# EasyEDA schematic schematic-easyeda.json
TITLE: Badge Adapter; REV: 1.0; Date: 2020-01-03; Sheet: 1/1; Drawn By: uri_6323; Company: Uri Shaked
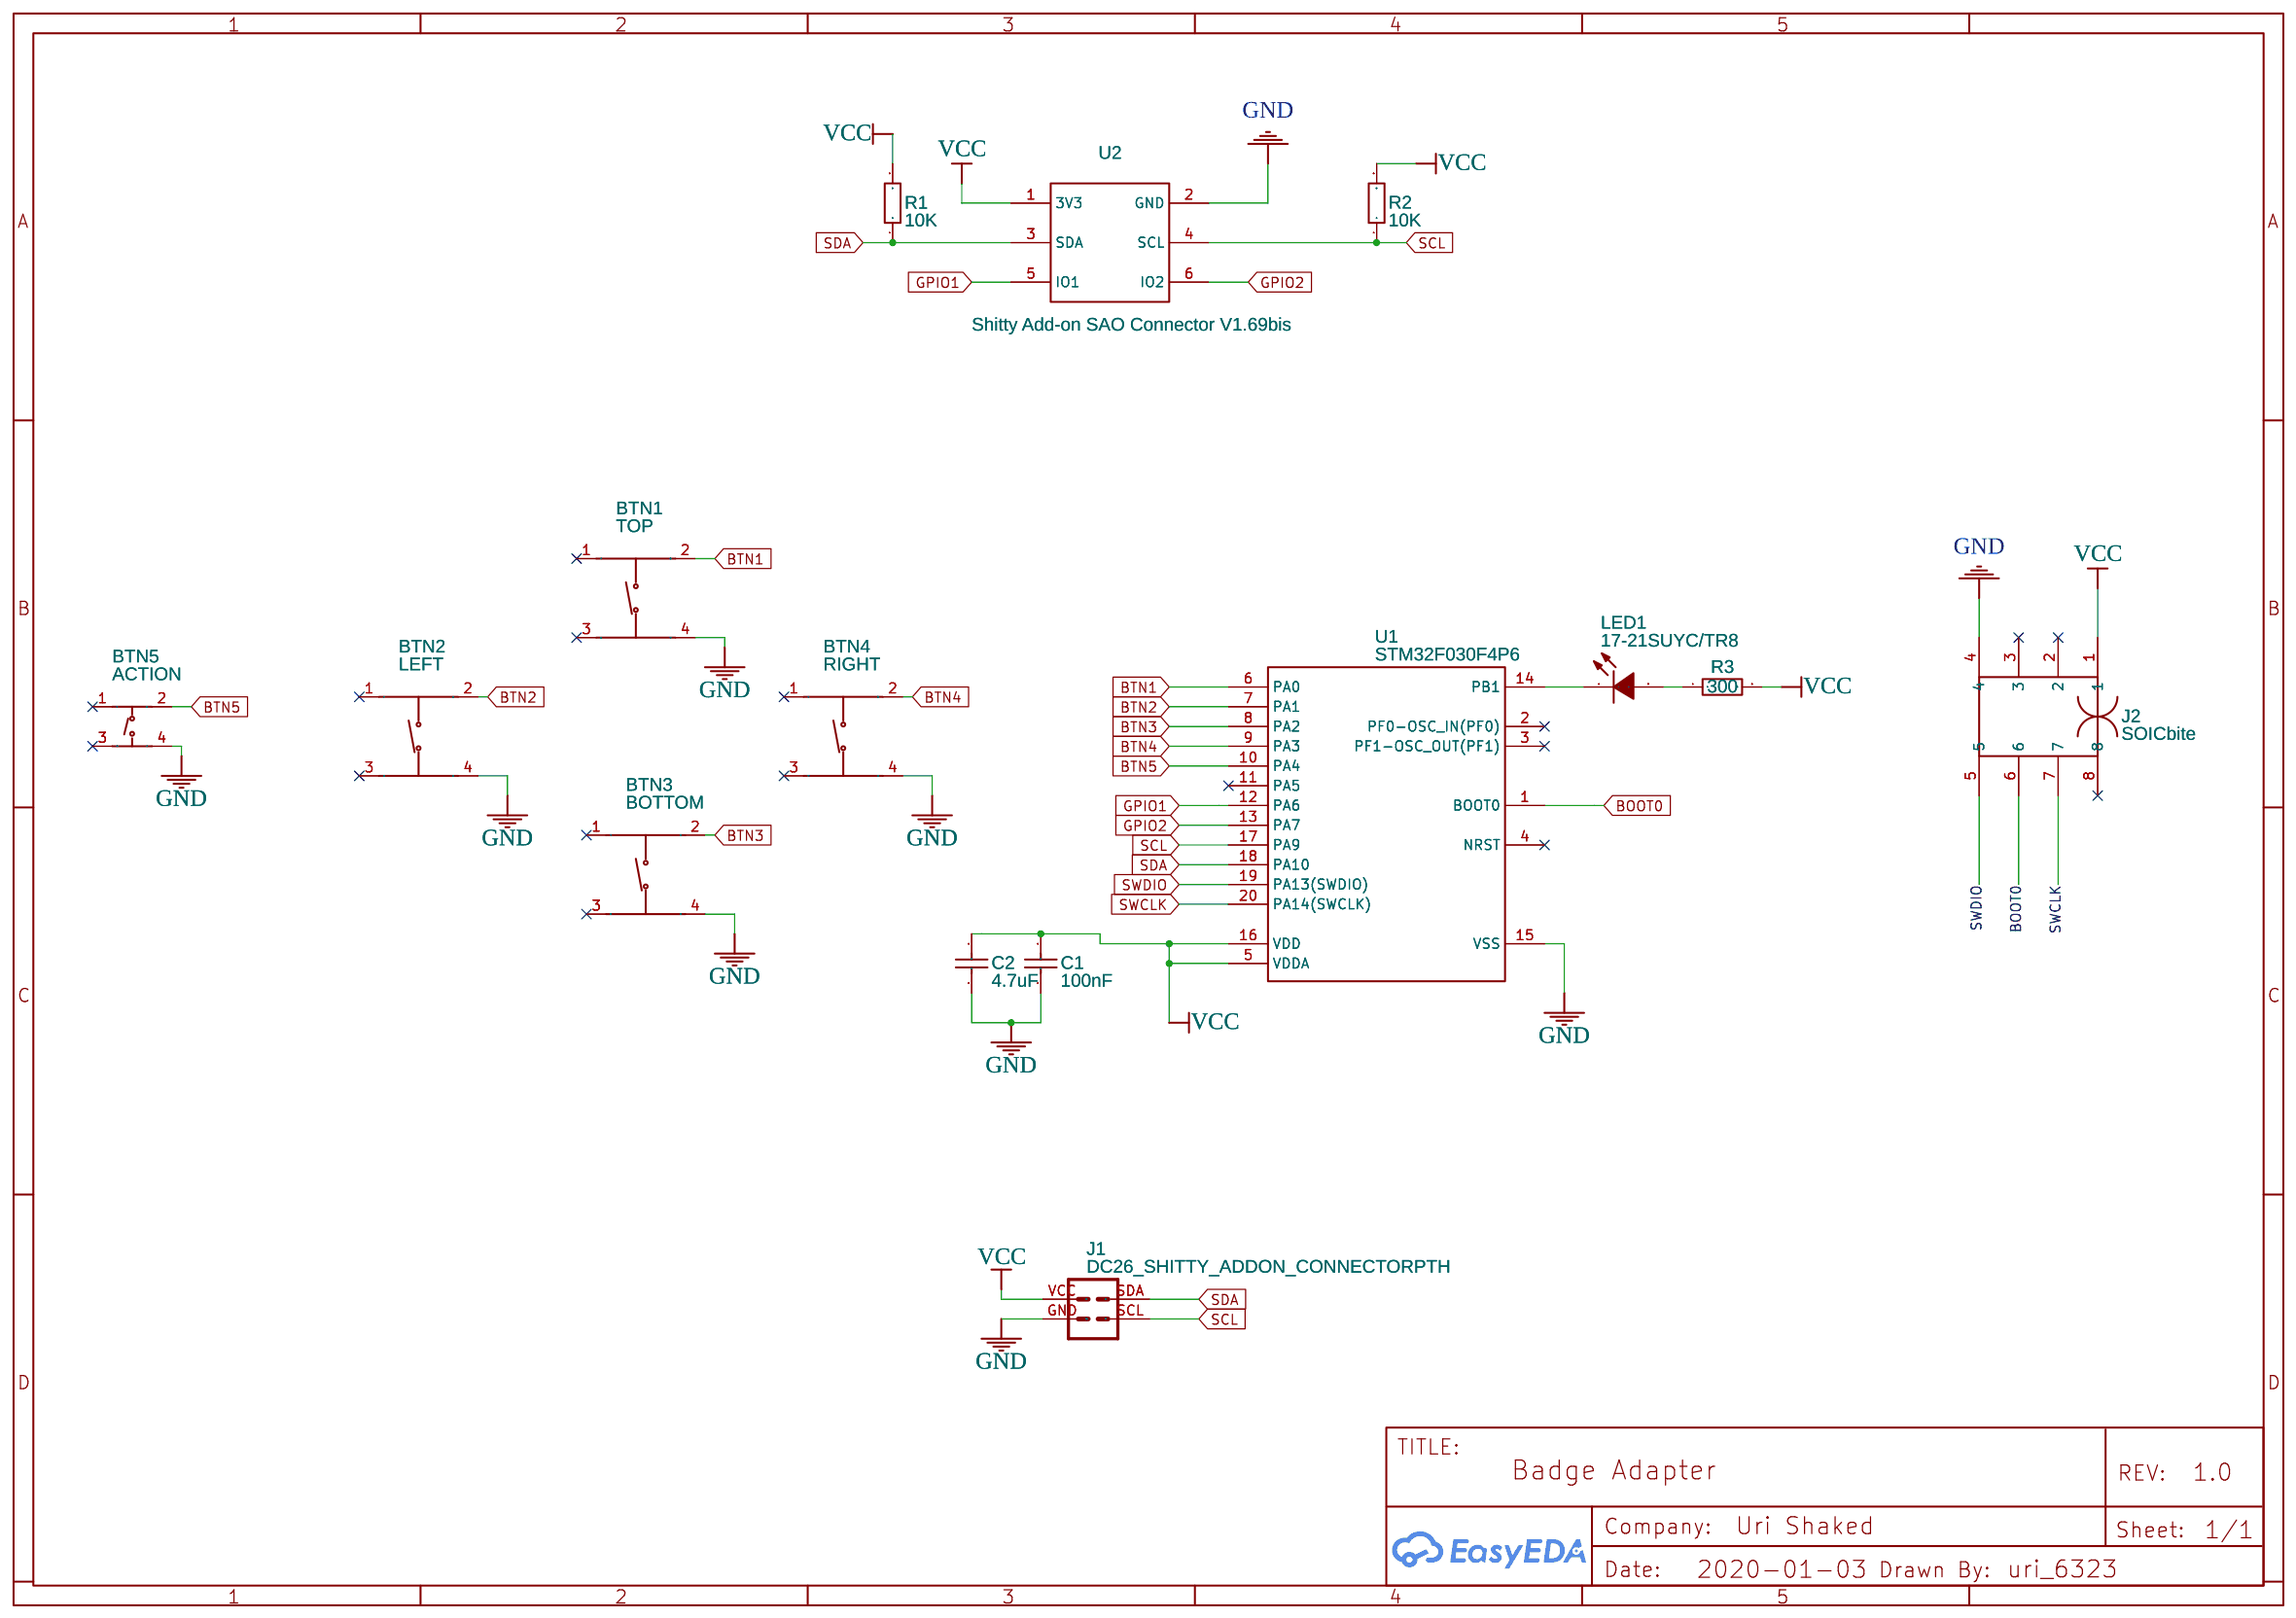
[diagram p0: schematic sheet]

## Parts
BTN1  TOP  [SW-TH_4P-L6.0-W6.0-P4.50-LS6.5]
BTN2  LEFT  [SW-TH_4P-L6.0-W6.0-P4.50-LS6.5]
BTN3  BOTTOM  [SW-TH_4P-L6.0-W6.0-P4.50-LS6.5]
BTN4  RIGHT  [SW-TH_4P-L6.0-W6.0-P4.50-LS6.5]
BTN5  ACTION  [SW-TH_4P-L6.0-W6.0-P4.50-LS6.5]
C1  100nF  [1206]
C2  4.7uF  [1206]
J1  DC26_SHITTY_ADDON_CONNECTORPTH  [DC26SHITTY_ADDON_CONNECTOR]
J2  SOICbite  [SOIC_CLIPPROGSMALL]
LED1  17-21SUYC/TR8  [LED0805-RD]
R1  10K  [1206]
R2  10K  [1206]
R3  300  [1206]
U1  STM32F030F4P6  [TSSOP-20_L6.5-W4.4-P0.65-LS6.4-BL]
U2  Shitty Add-on SAO Connector V1.69bis  [BADGE SAO V1.69]

## Library data of the parts
BTN1-BTN4 = TC-1102T-C: Supplier: LCSC; Supplier Part: C406163; Manufacturer: XKB Enterprise; Contributor: LCSC
BTN5 = 1TS005A-2400-5001: Supplier: LCSC; Supplier Part: C319406; Manufacturer: HYP; Contributor: LCSC
C1 = CL31B104KBCNNNC: Supplier: LCSC; Manufacturer: SAMSUNG; LCSC Assembly: Yes; Supplier Part: C24497; SMT Type: Basic
C2 = 1206B475K500NT: Supplier: LCSC; Manufacturer: FH; LCSC Assembly: Yes; Supplier Part: C29823; SMT Type: Basic
J1 = -: Contributor: Paolo Averi
J2 = -: link: https://github.com/SimonMerrett/SOICbite; Contributor: superpolynomialtime
LED1 = 17-21SUYC/TR8: Supplier: LCSC; Manufacturer: KENTO; LCSC Assembly: Yes; image: //image.lceda.cn/szlcsc/C2296.jpg; Supplier Part: C2296; SMT Type: Basic
R1 R2 = 1206W4F1002T5E: Supplier: LCSC; Manufacturer: UniOhm; LCSC Assembly: Yes; Supplier Part: C17902; SMT Type: Basic
R3 = 1206W4F3000T5E: Supplier: LCSC; Manufacturer: UniOhm; LCSC Assembly: Yes; Supplier Part: C17887; SMT Type: Basic
U1 = STM32F030F4P6: Supplier: LCSC; Manufacturer: STMicroelectronics; LCSC Assembly: Yes; image: //image.lceda.cn/szlcsc/C32908.jpg; Supplier Part: C32908; SMT Type: Basic
U2 = Shitty Add-on SAO Connector V1.69bis: link: https://hackaday.com/2019/03/20/introducing-the-shitty-add-on-v1-69bis-standard/; Contributor: ecenuig

## Nets
GND: BTN1.4(D) BTN2.4(D) BTN3.4(D) BTN4.4(D) BTN5.4 C1.1 C2.1 J1.GND J2.4 U1.15(VSS) U2.2(GND)
VCC: C1.2 C2.2 J1.VCC J2.1 R1.2 R2.2 R3.2 U1.5(VDDA) U1.16(VDD) U2.1(3V3)
BOOT0: J2.6 U1.1(BOOT0)
BTN1: BTN1.2(B) U1.6(PA0)
BTN2: BTN2.2(B) U1.7(PA1)
BTN3: BTN3.2(B) U1.8(PA2)
BTN4: BTN4.2(B) U1.9(PA3)
BTN5: BTN5.2 U1.10(PA4)
GPIO1: U1.12(PA6) U2.5(IO1)
GPIO2: U1.13(PA7) U2.6(IO2)
SCL: J1.SCL R2.1 U1.17(PA9) U2.4(SCL)
SDA: J1.SDA R1.1 U1.18(PA10) U2.3(SDA)
SWCLK: J2.7 U1.20(PA14(SWCLK))
SWDIO: J2.5 U1.19(PA13(SWDIO))
LED1_2: LED1.2(+) R3.1
U1_14: LED1.1(-) U1.14(PB1)

Not connected (* = marked no-connect by the designer): BTN1 1(A)* 3(C)*; BTN2 1(A)* 3(C)*; BTN3 1(A)* 3(C)*; BTN4 1(A)* 3(C)*; BTN5 1* 3*; J2 2* 3* 8*; U1 2(PF0-OSC_IN(PF0))* 3(PF1-OSC_OUT(PF1))* 4(NRST)* 11(PA5)*
